# Altium schematic sheet 600V_20A_MotorController_V2.0.SchDoc
size A1
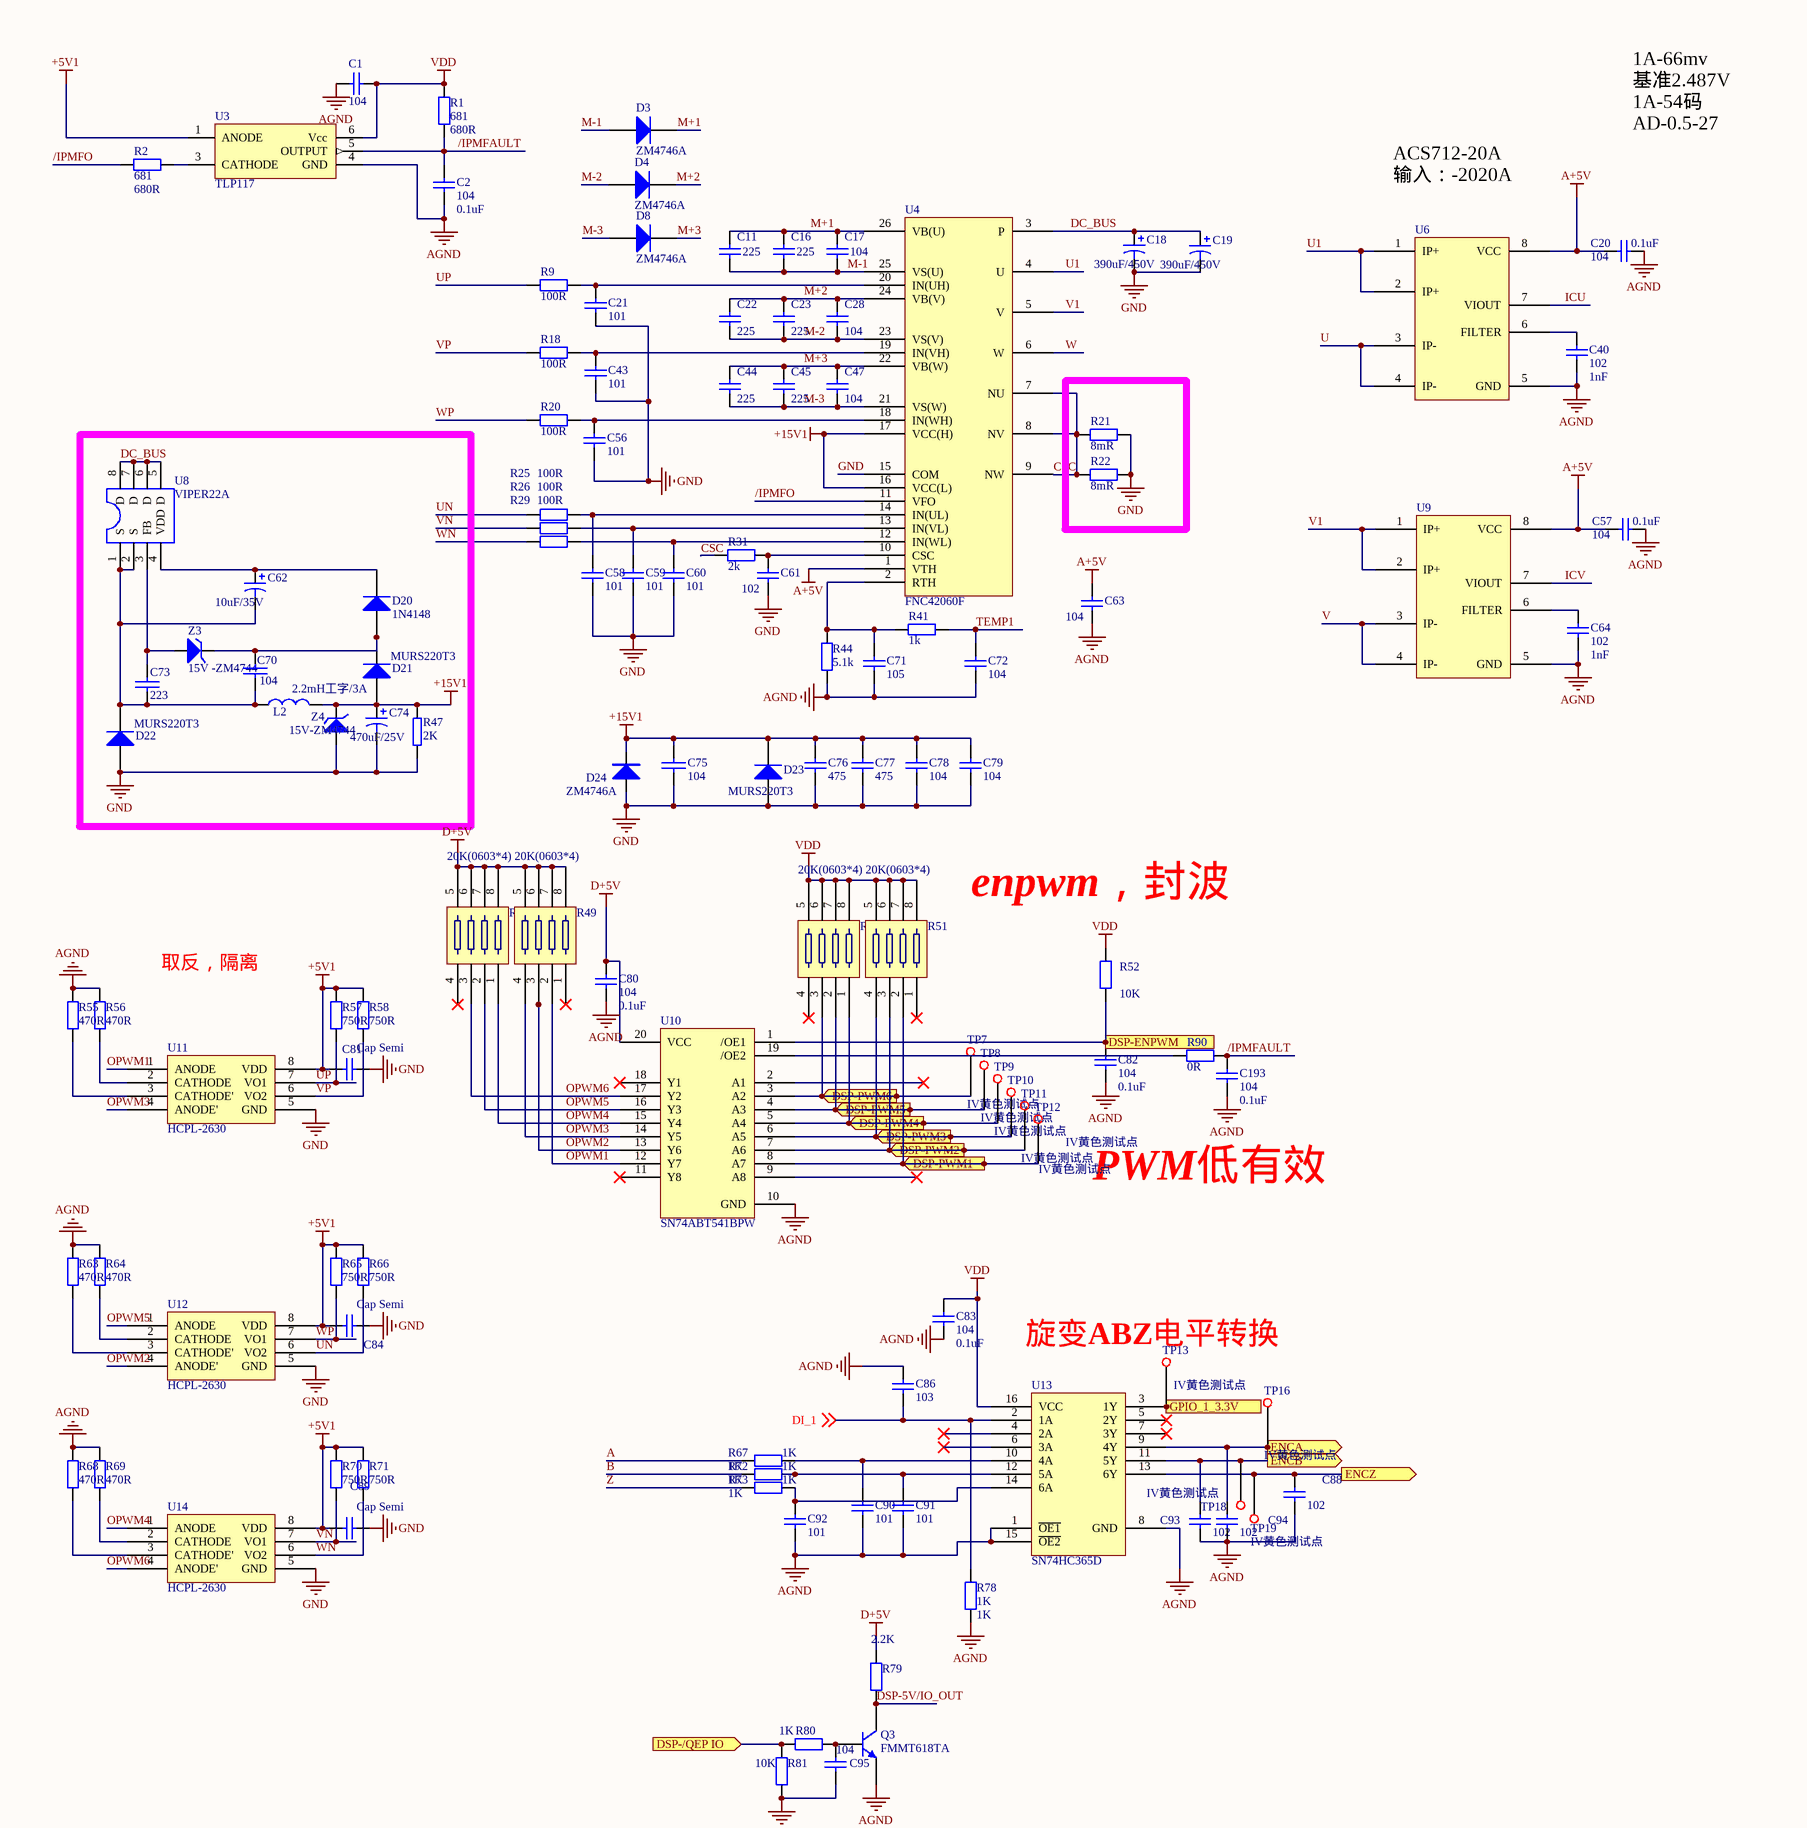
[diagram p0: 600V_20A_MotorController_V2.0.SchDoc, top left]
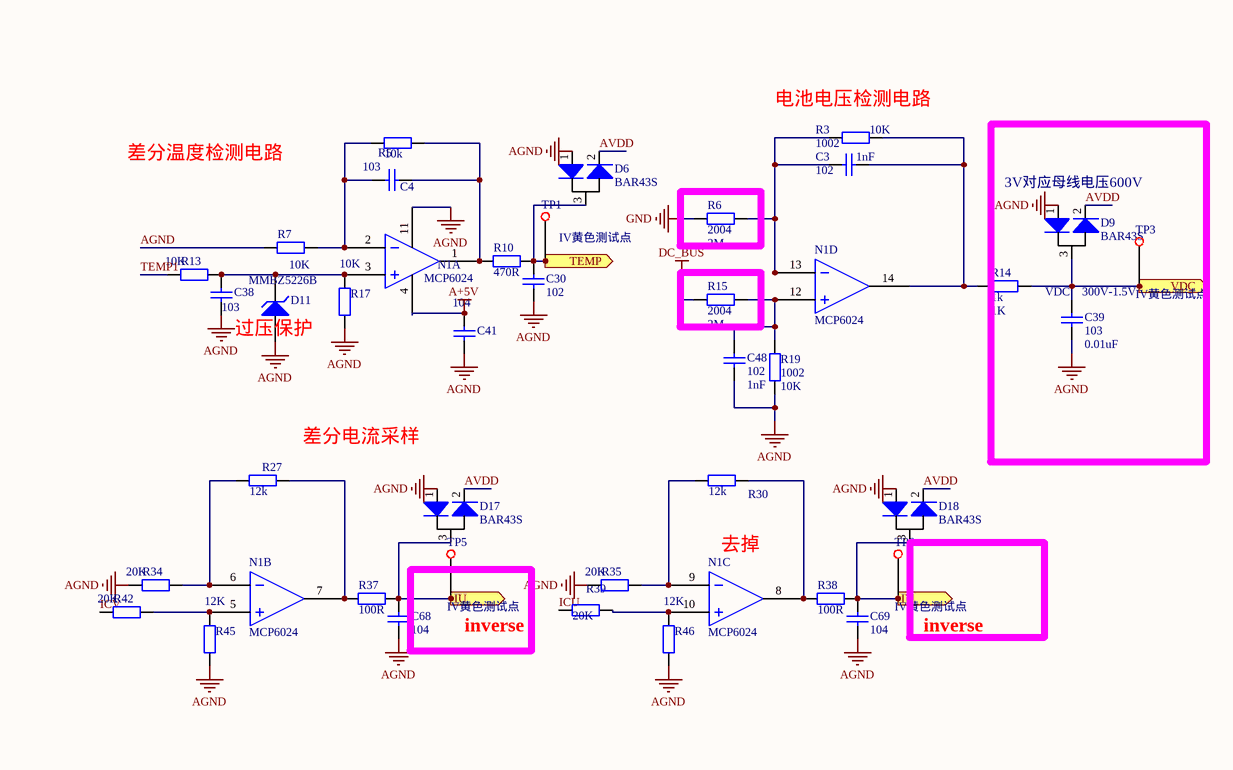
[diagram p1: 600V_20A_MotorController_V2.0.SchDoc, top middle]
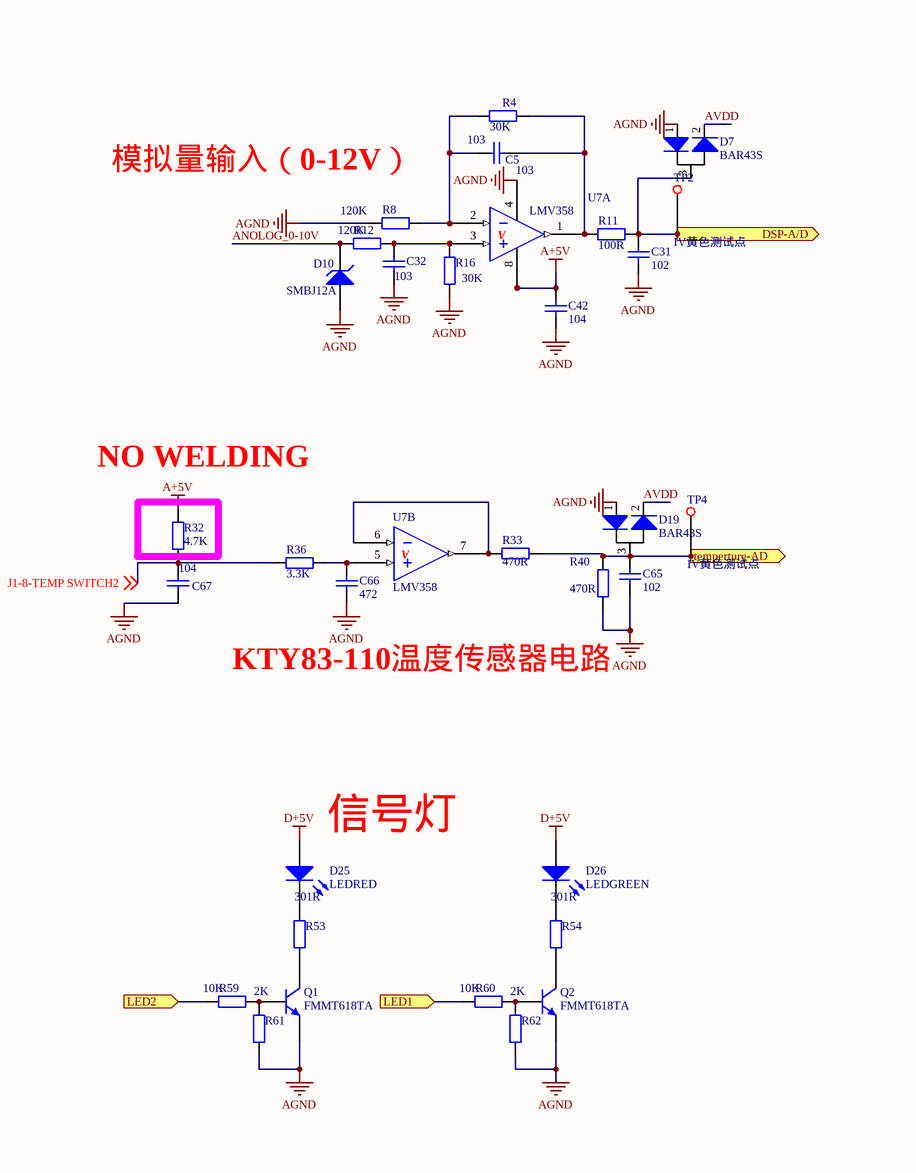
[diagram p2: 600V_20A_MotorController_V2.0.SchDoc, top right]
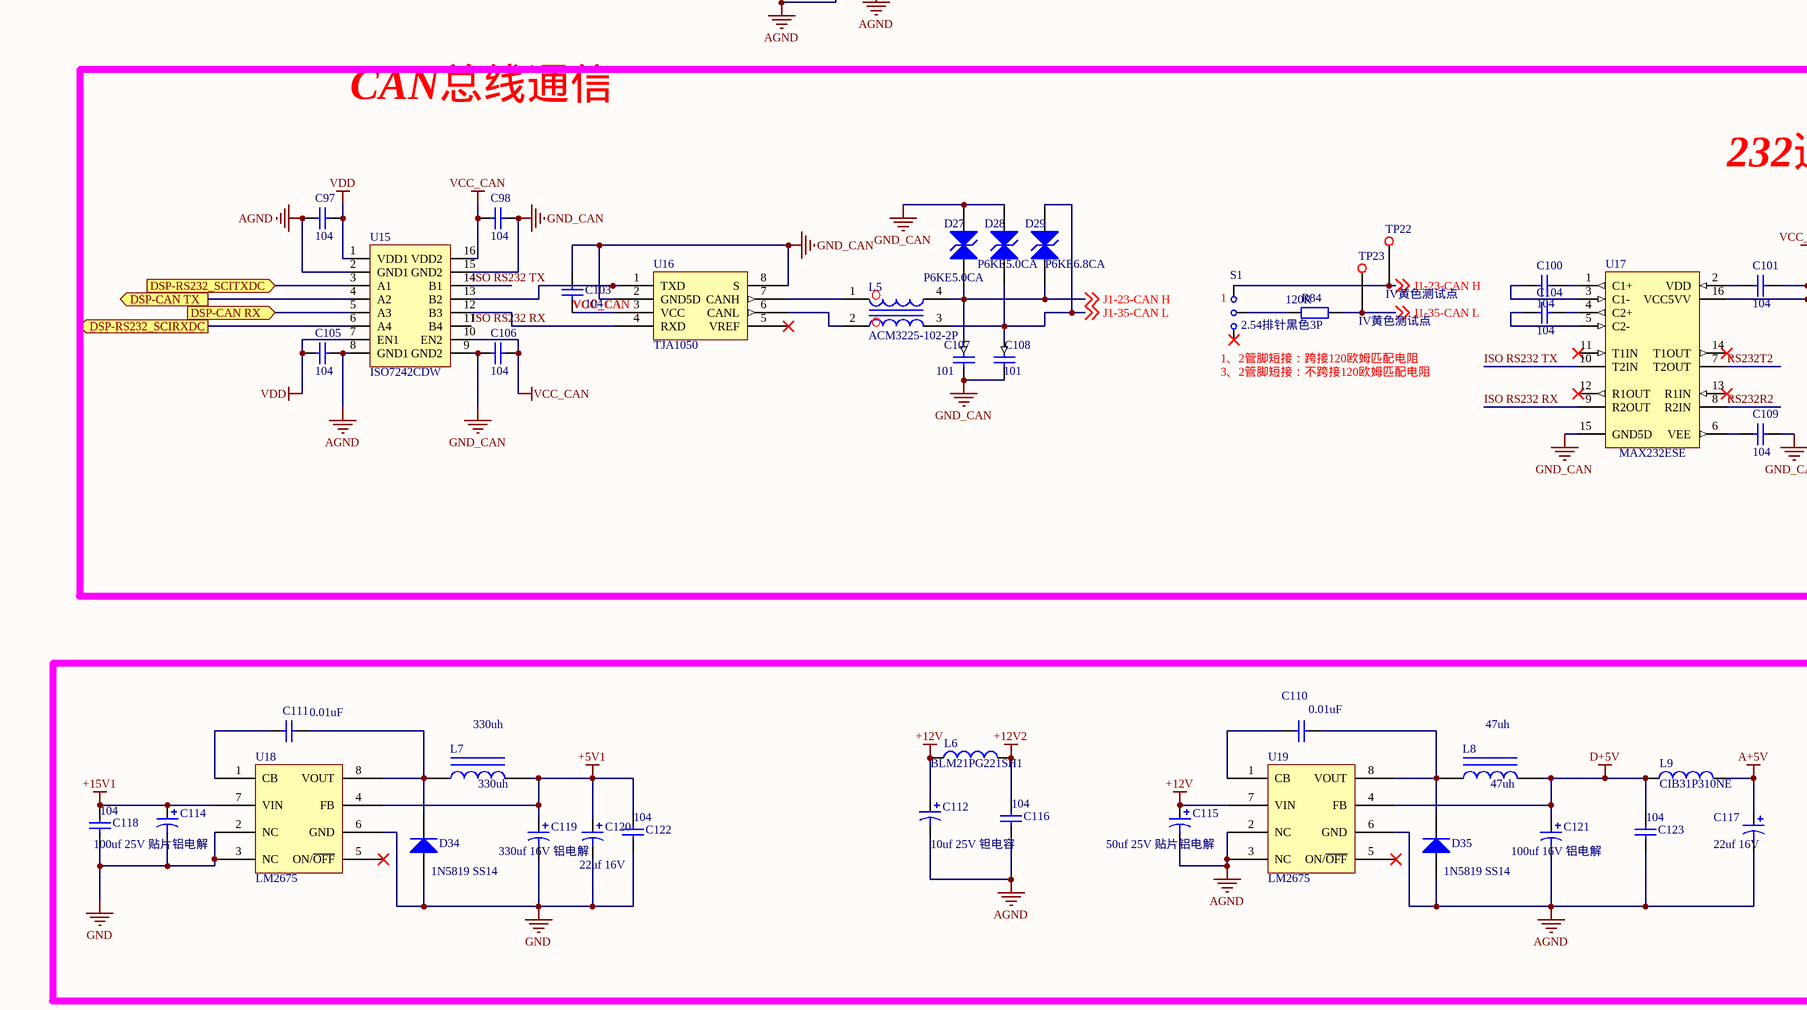
[diagram p3: 600V_20A_MotorController_V2.0.SchDoc, bottom left]
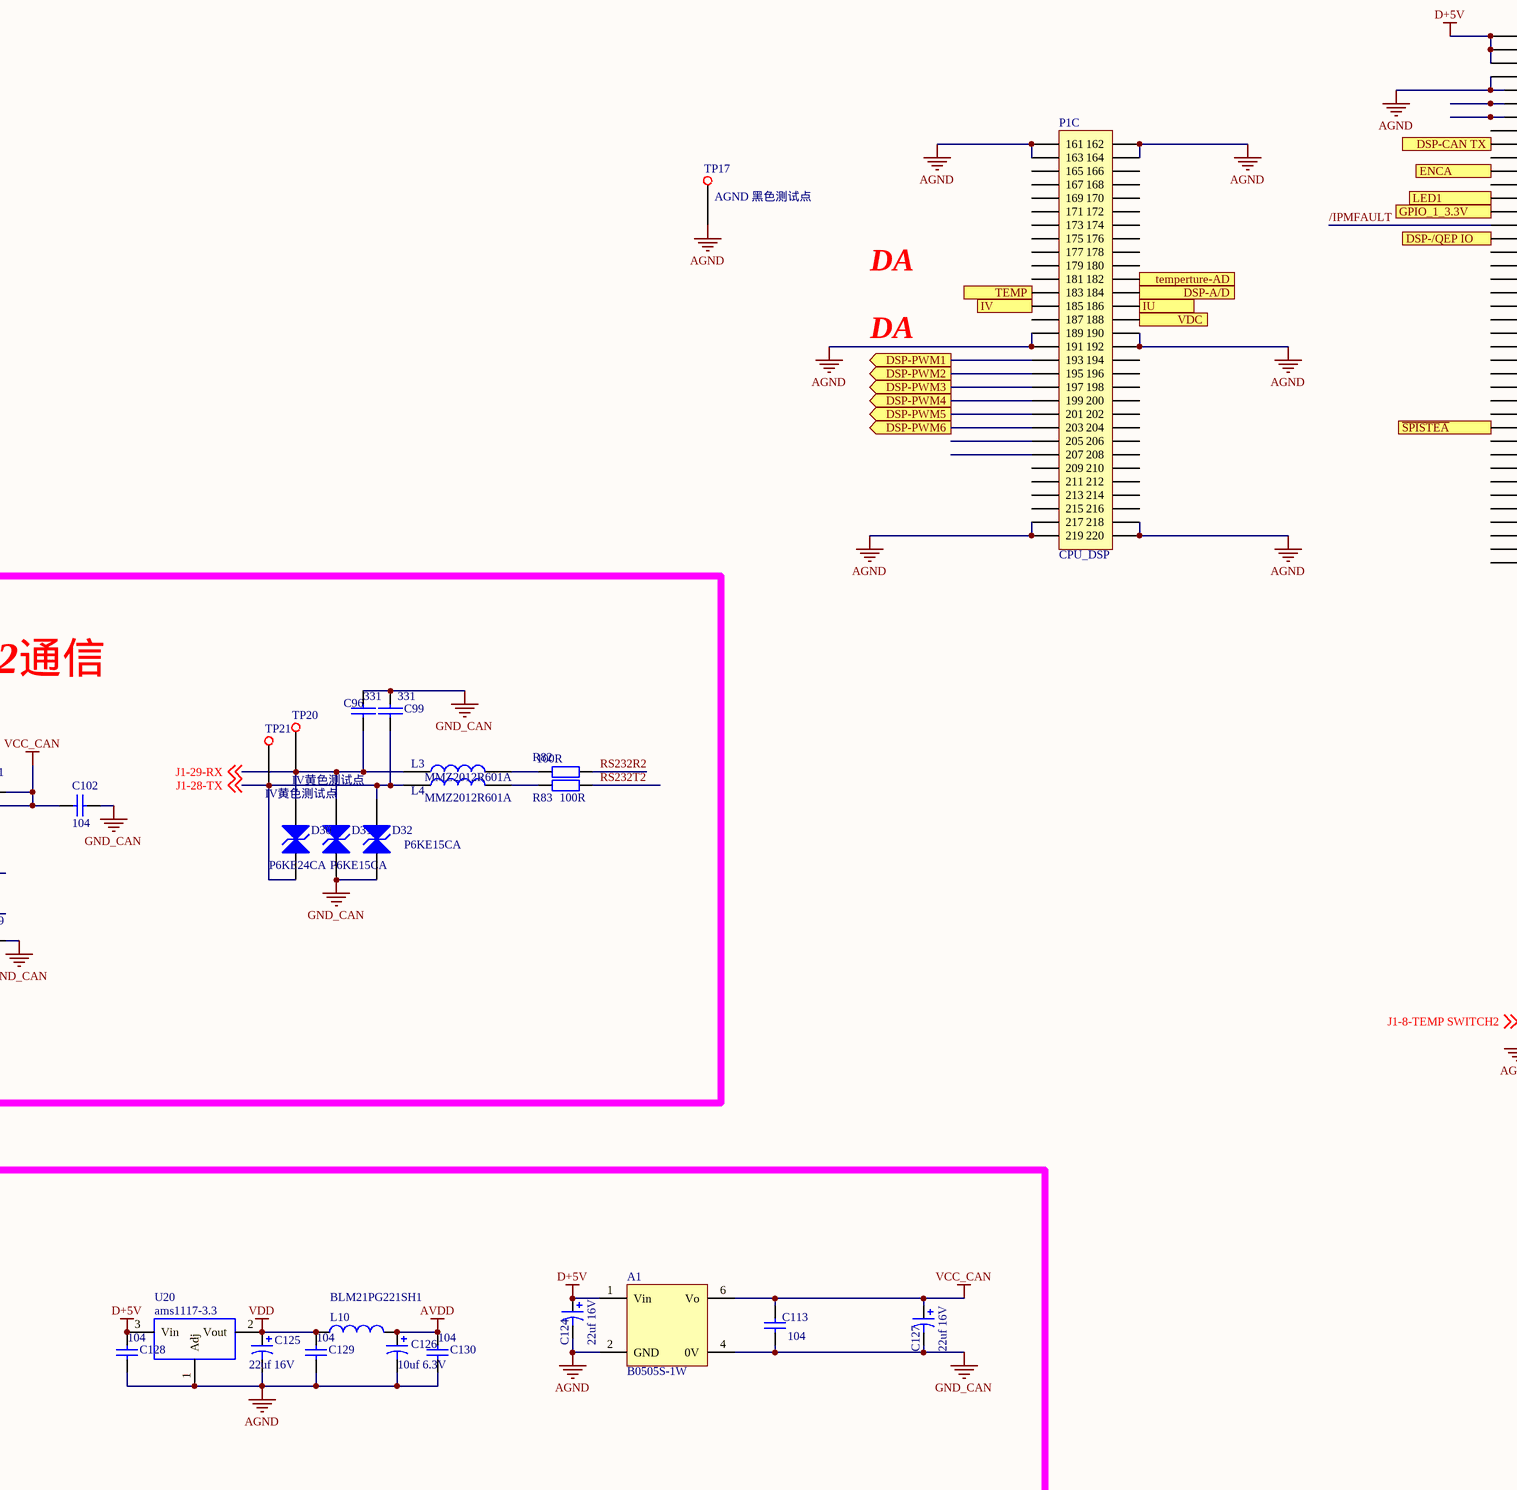
[diagram p4: 600V_20A_MotorController_V2.0.SchDoc, bottom middle]
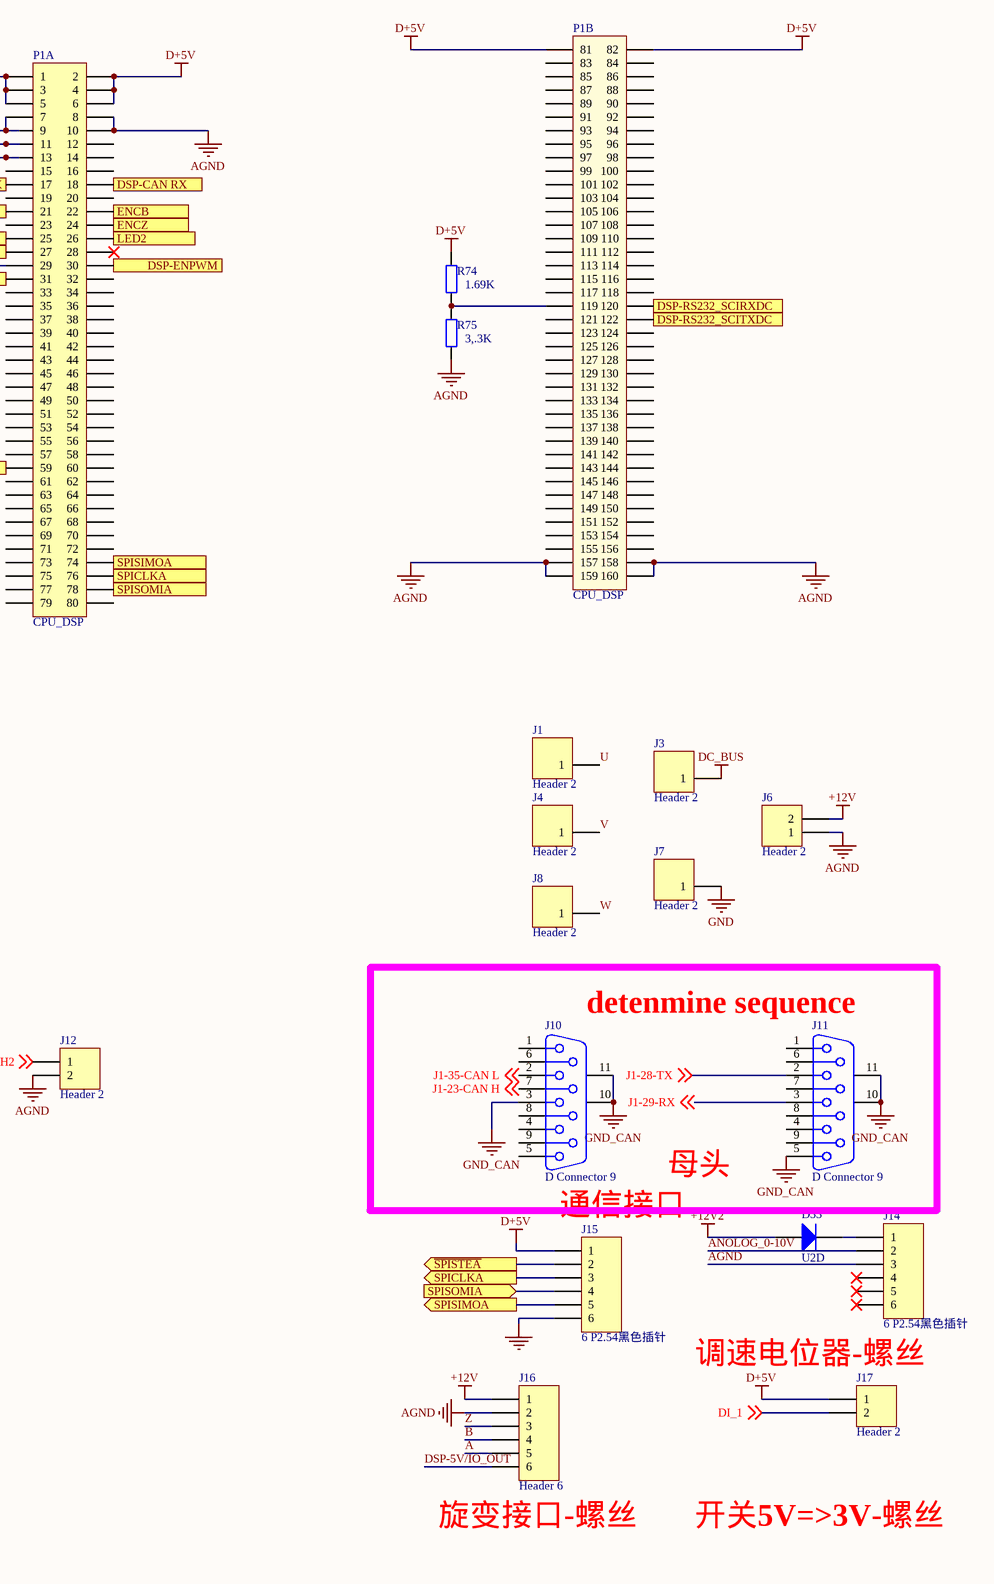
[diagram p5: 600V_20A_MotorController_V2.0.SchDoc, bottom right]

## Parts
A1  B0505S-1W  [B0505S-1W]
C1  Cap  [0805]  (value not drawn)
C2  104  value 0.1uF  [0805]
C3  102  value 1nF  [0805]
C4  103  [0805]
C5  103  [0805]
C11  225  [0805]
C16  225  [0805]
C17  104  [0805]
C18  390uF/450V  [CAP/30mm]
C19  390uF/450V  [CAP/30mm]
C20  104  value 0.1uF  [0805]
C21  101  [0805]
C22  225  [0805]
C23  225  [0805]
C28  104  [0805]
C30  102  [0805]
C31  102  [0805]
C32  103  [0805]
C38  103  [0805]
C39  103  value 0.01uF  [0805]
C40  102  value 1nF  [0805]
C41  104  [0805]
C42  104  [0805]
C43  101  [0805]
C44  225  [0805]
C45  225  [0805]
C47  104  [0805]
C48  102  value 1nF  [0805]
C56  101  [0805]
C57  104  value 0.1uF  [0805]
C58  101  [0805]
C59  101  [0805]
C60  101  [0805]
C61  102  [0805]
C62  10uF/35V  [CAP/6.4mm -]
C63  104  [0805]
C64  102  value 1nF  [0805]
C65  102  [0805]
C66  472  [0805]
C67  104  [0805]
C68  104  [0805]
C69  104  [0805]
C70  104  [0805]
C71  105  [0805]
C72  104  [0805]
C73  223  [0805]
C74  470uF/25V  [CAP/8mm]
C75  104  [0805]
C76  475  [0805]
C77  475  [0805]
C78  104  [0805]
C79  104  [0805]
C80  104  value 0.1uF  [0805]
C81  Cap Semi  [0805]
C82  104  value 0.1uF  [0805]
C83  104  value 0.1uF  [0805]
C84  Cap Semi  [0805]
C86  103  [0805]
C88  102  [0805]
C89  Cap Semi  [0805]
C90  101  [0805]
C91  101  [0805]
C92  101  [0805]
C93  102  [0805]
C94  102  [0805]
C95  104  [0805]
C96  331  [0805]
C97  104  [0805]
C98  104  [0805]
C99  331  [0805]
C100  104  [0805]
C101  104  [0805]
C102  104  [0805]
C103  104  [0805]
C104  104  [0805]
C105  104  [0805]
C106  104  [0805]
C107  101  [0805]
C108  101  [0805]
C109  104  [0805]
C110  0.01uF  [0805]
C111  0.01uF  [0805]
C112  10uf 25V 钽电容  [1206 (钽电容)]
C113  104  [0805]
C114  100uf 25V 贴片铝电解  [CAP/6.4mm -]
C115  50uf 25V 贴片铝电解  [CAP/6.4mm -]
C116  104  [0805]
C117  22uf 16V  [1206 (钽电容)]
C118  104  [0805]
C119  330uf 16V 铝电解  [CAP/8mm]
C120  22uf 16V  [1206 (钽电容)]
C121  100uf 16V 铝电解  [CAP/8mm]
C122  104  [0805]
C123  104  [0805]
C124  22uf 16V  [1206 (钽电容)]
C125  22uf 16V  [1206 (钽电容)]
C126  10uf 6.3V  [1206 (钽电容)]
C127  22uf 16V  [1206 (钽电容)]
C128  104  [0805]
C129  104  [0805]
C130  104  [0805]
C193  104  value 0.1uF  [0805]
D3  ZM4746A  [LL4148]
D4  ZM4746A  [LL4148]
D6  BAR43S  [SOT-23]
D7  BAR43S  [SOT-23]
D8  ZM4746A  [LL4148]
D9  BAR43S  [SOT-23]
D10  SMBJ12A  [DO214AA]
D11  MMBZ5226B  [SOT-23]
D17  BAR43S  [SOT-23]
D18  BAR43S  [SOT-23]
D19  BAR43S  [SOT-23]
D20  1N4148  [LL4148]
D21  MURS220T3  [DO214AA]
D22  MURS220T3  [DO214AA]
D23  MURS220T3  [DO214AA]
D24  ZM4746A  [LL4148]
D25  LEDRED  [L0805]
D26  LEDGREEN  [L0805]
D27  P6KE5.0CA  [DO214AA]
D28  P6KE5.0CA  [DO214AA]
D29  P6KE6.8CA  [DO214AA]
D30  P6KE24CA  [DO214AA]
D31  P6KE15CA  [DO214AA]
D32  P6KE15CA  [DO214AA]
D33  U2D  [DO214AC]
D34  1N5819 SS14  [DO214AC]
D35  1N5819 SS14  [DO214AC]
J1  Header 2  [PCB焊接端子]
J3  Header 2  [PCB焊接端子]
J4  Header 2  [PCB焊接端子]
J6  Header 2  [381S-2]
J7  Header 2  [PCB焊接端子]
J8  Header 2  [PCB焊接端子]
J10  D Connector 9  [DSUB1.385-2H9]
J11  D Connector 9  [DSUB1.385-2H9]
J12  Header 2  [381S-2]
J14  6 P2.54黑色插针  [381S-6]
J15  6 P2.54黑色插针  [6P 100mil]
J16  Header 6  [381S-6]
J17  Header 2  [381S-2]
L2  2.2mH工字/3A  [L\5\10]
L3  MMZ2012R601A  [0805]
L4  MMZ2012R601A  [0805]
L5  ACM3225-102-2P  [ACM3225]
L6  BLM21PG221SH1  [0805]
L7  330uh  [L_7*7]
L8  47uh  [L_7*7]
L9  CIB31P310NE  [1206]
L10  BLM21PG221SH1  [0805]
N1  MCP6024  [SOIC14_M]  (parts A,B,C,D of 4)
P1  CPU_DSP  [DSP_240]  (parts A,B,C of 3)
Q1  FMMT618TA  [SOT-23]
Q2  FMMT618TA  [SOT-23]
Q3  FMMT618TA  [SOT-23]
R1  681  value 680R  [0805]
R2  681  value 680R  [0805]
R3  1002  value 10K  [0805]
R4  30K  [0805]
R5  10k  [0805]
R6  2004  value 2M  [1206]
R7  10K  [0805]
R8  120K  [0805]
R9  100R  [0805]
R10  470R  [0805]
R11  100R  [0805]
R12  120K  [0805]
R13  10K  [0805]
R14  1k  [0805]
R15  2004  value 2M  [1206]
R16  30K  [0805]
R17  10K  [0805]
R18  100R  [0805]
R19  1002  value 10K  [0805]
R20  100R  [0805]
R21  8mR  [2512]
R22  8mR  [2512]
R25  100R  [0805]
R26  100R  [0805]
R27  12k  [0805]
R29  100R  [0805]
R30  12k  [0805]
R31  2k  [0805]
R32  4.7K  [0805]
R33  470R  [0805]
R34  20K  [0805]
R35  20K  [0805]
R36  3.3K  [0805]
R37  100R  [0805]
R38  100R  [0805]
R39  20K  [0805]
R40  470R  [0805]
R41  1k  [0805]
R42  20K  [0805]
R44  5.1k  [0805]
R45  12K  [0805]
R46  12K  [0805]
R47  2K  [1206]
R48  20K(0603*4)  [R_NET4]
R49  20K(0603*4)  [R_NET4]
R50  20K(0603*4)  [R_NET4]
R51  20K(0603*4)  [R_NET4]
R52  10K  [0805]
R53  301R  [0805]
R54  301R  [0805]
R55  470R  [0805]
R56  470R  [0805]
R57  750R  [0805]
R58  750R  [0805]
R59  10K  [0805]
R60  10K  [0805]
R61  2K  [0805]
R62  2K  [0805]
R63  470R  [0805]
R64  470R  [0805]
R65  750R  [0805]
R66  750R  [0805]
R67  1K  [0805]
R68  470R  [0805]
R69  470R  [0805]
R70  750R  [0805]
R71  750R  [0805]
R72  1K  [0805]
R73  1K  [0805]
R74  1.69K  [0805]
R75  3,.3K  [0805]
R78  1K  [0805]
R79  2.2K  [0805]
R80  1K  [0805]
R81  10K  [0805]
R82  100R  [0805]
R83  100R  [0805]
R84  120R  [0805]
R90  0R  [0805]
S1  2.54排针黑色3P  [SIP3]
TP1  IV黄色测试点  [TP]
TP2  IV黄色测试点  [TP]
TP3  IV黄色测试点  [TP]
TP4  IV黄色测试点  [TP]
TP5  IV黄色测试点  [TP]
TP6  IV黄色测试点  [TP]
TP7  IV黄色测试点  [TP]
TP8  IV黄色测试点  [TP]
TP9  IV黄色测试点  [TP]
TP10  IV黄色测试点  [TP]
TP11  IV黄色测试点  [TP]
TP12  IV黄色测试点  [TP]
TP13  IV黄色测试点  [TP]
TP16  IV黄色测试点  [TP]
TP17  AGND 黑色测试点  [TP]
TP18  IV黄色测试点  [TP]
TP19  IV黄色测试点  [TP]
TP20  IV黄色测试点  [TP]
TP21  IV黄色测试点  [TP]
TP22  IV黄色测试点  [TP]
TP23  IV黄色测试点  [TP]
U3  TLP117  [TLP113]
U4  FNC42060F  [FNC42060F]
U6  ACS712  [SOIC-8]  (value not drawn)
U7  LMV358  [so-8]  (parts A,B of 2)
U8  VIPER22A  [DIP8]
U9  ACS712  [SOIC-8]  (value not drawn)
U10  SN74ABT541BPW  [TSSOP-20]
U11  HCPL-2630  [DIP8]
U12  HCPL-2630  [DIP8]
U13  SN74HC365D  [D016_N]
U14  HCPL-2630  [DIP8]
U15  ISO7242CDW  [SOIC16_L]
U16  TJA1050  [sot96-1_n]
U17  MAX232ESE  [NSO16_N]
U18  LM2675  [SOIC-8]
U19  LM2675  [SOIC-8]
U20  ams1117-3.3  [SOT-223]
Z3  15V -ZM4744  [LL4148]
Z4  15V-ZM4744  [LL4148]

## Blocks framed on the sheet
3V对应母线电压600V: C39 D9 R14 TP3

## Ports
DSP-/QEP IO (in), DSP-/QEP IO (out), DSP-A/D (in), DSP-A/D (out), DSP-CAN RX (in), DSP-CAN RX (out), DSP-CAN TX (in), DSP-CAN TX (out), DSP-ENPWM (in), DSP-ENPWM (out), DSP-PWM1 (in), DSP-PWM1 (out), DSP-PWM2 (in), DSP-PWM2 (out), DSP-PWM3 (in), DSP-PWM3 (out), DSP-PWM4 (in), DSP-PWM4 (out), DSP-PWM5 (in), DSP-PWM5 (out), DSP-PWM6 (in), DSP-PWM6 (out), DSP-RS232_SCIRXDC (in), DSP-RS232_SCIRXDC (out), DSP-RS232_SCITXDC (in), DSP-RS232_SCITXDC (out), ENCA (in), ENCA (out), ENCB (in), ENCB (out), ENCZ (in), ENCZ (out), GPIO_1_3.3V (in), GPIO_1_3.3V (out), IU (in), IU (out), IV (in), IV (out), LED1 (in), LED1 (out), LED2 (in), LED2 (out), SPICLKA (in), SPICLKA (out), SPISIMOA (in), SPISIMOA (out), SPISOMIA (in), SPISOMIA (out), TEMP (in), TEMP (out), temperture-AD (in), temperture-AD (out), VDC (in), VDC (out), ~{SPISTEA} (in), ~{SPISTEA} (out)

## Nets
+5V1: C81.1 C84.1 C89.1 C119.1 C120.1 C122.2 L7.2 R57.2 R58.2 R65.2 R66.2 R70.2 R71.2 U3.1(ANODE) U11.8(VDD) U12.8(VDD) U14.8(VDD) U18.4(FB)
+12V: C112.1 C115.1 J6.2 J16.1 L6.1 U19.7(VIN)
+12V2: C116.2 D33.1 L6.2
+15V1: C74.1 C75.1 C76.2 C77.2 C78.2 C79.2 C114.1 C118.2 D21.1(A) D23.2(K) D24.2(K) L2.2 R47.1 U4.16(VCC(L)) U4.17(VCC(H)) U18.7(VIN) Z4.2(K)
A+5V: C20.2 C41.2 C42.2 C57.2 C63.2 C117.1 L9.2 N1.4 R32.1 U4.1(VTH) U6.8(VCC) U7.8 U9.8(VCC)
AGND: A1.2(GND) C1.1 C2.1 C20.1 C30.1 C31.1 C32.1 C38.1 C39.1 C40.1 C41.1 C42.1 C48.1 C57.1 C63.1 C64.1 C65.1 C66.1 C67.1 C68.1 C69.1 C71.1 C72.1 C80.2 C82.1 C83.2 C86.1 C88.2 C90.2 C91.2 C92.2 C93.2 C94.2 C95.2 C97.1 C105.2 C112.2 C115.2 C116.1 C117.2 C121.2 C123.1 C124.2 C125.2 C126.2 C128.1 C129.1 C130.1 C193.1 D6.1 D7.1 D9.1 D10.1(A) D11.1 D17.1 D18.1 D19.1 D35.1 J6.1 J12.2 J14.3 J15.6 J16.2 N1.11 P1.7 P1.8 P1.9 P1.10 P1.157 P1.158 P1.159 P1.160 P1.161 P1.162 P1.163 P1.164 P1.189 P1.190 P1.191 P1.192 P1.217 P1.218 P1.219 P1.220 Q1.2(E) Q2.2(E) Q3.2(E) R7.2 R8.2 R16.2 R17.2 R19.1 R34.2 R35.2 R40.1 R44.1 R45.2 R46.2 R55.2 R56.2 R61.2 R62.2 R63.2 R64.2 R68.2 R69.2 R75.1 R78.1 R81.2 TP17.1 U3.4(GND) U6.5(GND) U7.4 U9.5(GND) U10.10(GND) U13.1(~{OE1}) U13.8(GND) U13.15(~{OE2}) U15.2(GND1) U15.8(GND1) U19.2(NC) U19.3(NC) U19.6(GND) U20.1(Adj)
AVDD: C126.1 C130.2 D6.2 D7.2 D9.2 D17.2 D18.2 D19.2 L10.2
D+5V: A1.1(Vin) C80.1 C121.1 C123.2 C124.1 C128.2 D25.1(A) D26.1(A) J15.1 J17.1 L8.2 L9.1 P1.1 P1.2 P1.3 P1.4 P1.5 P1.6 P1.81 P1.82 R48.5(SDA) R48.6(SCL) R48.7(SQW/OUT) R48.8(VCC) R49.5(SDA) R49.6(SCL) R49.7(SQW/OUT) R49.8(VCC) R74.2 R79.2 U10.20(VCC) U19.4(FB) U20.3(Vin)
DC_BUS: C18.1 C19.1 J3.1 R15.1 U4.3(P) U8.5(D) U8.6(D) U8.7(D) U8.8(D)
GND: C18.2 C19.2 C21.1 C43.1 C56.1 C58.1 C59.1 C60.1 C61.1 C74.2 C75.2 C76.1 C77.1 C78.1 C79.1 C81.2 C84.2 C89.2 C114.2 C118.1 C119.2 C120.2 C122.1 D22.1(A) D23.1(A) D24.1(A) D34.1 J7.1 R6.1 R21.1 R22.1 R47.2 U4.15(COM) U11.5(GND) U12.5(GND) U14.5(GND) U18.2(NC) U18.3(NC) U18.6(GND) Z4.1(A)
GND_CAN: A1.4(0V) C96.1 C98.2 C99.1 C102.2 C103.1 C106.1 C107.1 C108.1 C109.2 C113.1 C127.2 D27.2(K) D28.2(K) D31.1(A) D32.1(A) J10.3 J10.10(MH1) J10.11(MH2) J11.5 J11.10(MH1) J11.11(MH2) U15.9(GND2) U15.15(GND2) U16.2(GND5D) U16.8(S) U17.15(GND5D)
VCC_CAN: A1.6(Vo) C98.1 C101.2 C102.1 C103.2 C106.2 C113.2 C127.1 U15.10(EN2) U15.16(VDD2) U16.3(VCC) U17.16(VCC5VV)
VDD: C1.2 C83.1 C97.2 C105.1 C125.1 C129.2 L10.1 R1.2 R50.5(SDA) R50.6(SCL) R50.7(SQW/OUT) R50.8(VCC) R51.5(SDA) R51.6(SCL) R51.7(SQW/OUT) R51.8(VCC) R52.2 U3.6(Vcc) U13.16(VCC) U15.1(VDD1) U15.7(EN1) U20.2(Vout)
/IPMFAULT: C2.2 C193.2 P1.29 R1.1 R90.1 U3.5(OUTPUT)
/IPMFO: R2.1 U4.11(VFO)
A: J16.5 R67.1
ANOLOG_0-10V: D10.2(K) J14.2 R12.1
B: J16.4 R72.1
CSC: R21.2 R22.2 R31.2 U4.7(NU) U4.8(NV) U4.9(NW)
DI_1: C86.2 J17.2 R78.2 U13.2(1A) ; off-sheet DI_1
DSP-5V/IO_OUT: J16.6 Q3.3(C) R79.1
DSP-/QEP IO: P1.31 R80.2 R81.1 ; port DSP-/QEP IO
DSP-A/D: C31.2 D7.3 P1.184 R11.1 TP2.1 ; port DSP-A/D
DSP-CAN RX: P1.18 U15.5(A3) ; port DSP-CAN RX
DSP-CAN TX: P1.17 U15.4(A2) ; port DSP-CAN TX
DSP-ENPWM: C82.2 P1.30 R52.1 U10.1(/OE1) ; port DSP-ENPWM
DSP-PWM1: P1.193 R51.2(X2) TP12.1 U10.8(A7) ; port DSP-PWM1
DSP-PWM2: P1.195 R51.3(V-BAT) TP11.1 U10.7(A6) ; port DSP-PWM2
DSP-PWM3: P1.197 R51.4(VSS) TP10.1 U10.6(A5) ; port DSP-PWM3
DSP-PWM4: P1.199 R50.1(X1) TP9.1 U10.5(A4) ; port DSP-PWM4
DSP-PWM5: P1.201 R50.2(X2) TP8.1 U10.4(A3) ; port DSP-PWM5
DSP-PWM6: P1.203 R50.3(V-BAT) TP7.1 U10.3(A2) ; port DSP-PWM6
DSP-RS232_SCIRXDC: P1.120 U15.6(A4) ; port DSP-RS232_SCIRXDC
DSP-RS232_SCITXDC: P1.122 U15.3(A1) ; port DSP-RS232_SCITXDC
ENCA: C94.1 P1.21 TP16.1 U13.9(4Y) ; port ENCA
ENCB: C93.1 P1.22 TP18.1 U13.11(5Y) ; port ENCB
ENCZ: C88.1 P1.24 TP19.1 U13.13(6Y) ; port ENCZ
GPIO_1_3.3V: P1.27 TP13.1 U13.3(1Y) ; port GPIO_1_3.3V
ICU: R39.1 U6.7(VIOUT)
ICV: R42.1 U9.7(VIOUT)
ISO RS232 RX: U15.11(B4) U17.9(R2OUT)
ISO RS232 TX: U15.14(B1) U17.10(T2IN)
IU: C68.2 D17.3 P1.186 R37.1 TP5.1 ; port IU
IV: C69.2 D18.3 P1.185 R38.1 TP6.1 ; port IV
J1-8-TEMP SWITCH2: C67.2 J12.1 R32.2 R36.1 ; off-sheet J1-8-TEMP SWITCH2
J1-23-CAN H: C107.2 D27.1(A) D29.1(A) J10.7 L5.4(Sec-) S1.1 TP22.1 ; off-sheet J1-23-CAN H
J1-28-TX: C99.2 D30.1(A) D32.2(K) J11.2 L4.1 TP21.1 ; off-sheet J1-28-TX
J1-29-RX: C96.2 D30.2(K) D31.2(K) J11.3 L3.1 TP20.1 ; off-sheet J1-29-RX
J1-35-CAN L: C108.2 D28.1(A) D29.2(K) J10.2 L5.3(Pri+) R84.1 TP23.1 ; off-sheet J1-35-CAN L
LED1: P1.25 R60.2 ; port LED1
LED2: P1.26 R59.2 ; port LED2
M+1: C11.1 C16.1 C17.1 D3.2(K) U4.26(VB(U))
M+2: C22.1 C23.1 C28.1 D4.2(K) U4.24(VB(V))
M+3: C44.1 C45.1 C47.1 D8.2(K) U4.22(VB(W))
M-1: C11.2 C16.2 C17.2 D3.1(A) U4.25(VS(U))
M-2: C22.2 C23.2 C28.2 D4.1(A) U4.23(VS(V))
M-3: C44.2 C45.2 C47.2 D8.1(A) U4.21(VS(W))
OPWM1: R49.2(X2) U10.12(Y7) U11.1(ANODE)
OPWM2: R49.3(V-BAT) U10.13(Y6) U12.4(ANODE')
OPWM3: R49.4(VSS) U10.14(Y5) U11.4(ANODE')
OPWM4: R48.1(X1) U10.15(Y4) U14.1(ANODE)
OPWM5: R48.2(X2) U10.16(Y3) U12.1(ANODE)
OPWM6: R48.3(V-BAT) U10.17(Y2) U14.4(ANODE')
RS232R2: R82.1 U17.8(R2IN)
RS232T2: R83.1 U17.7(T2OUT)
~{SPISTEA}: J15.2 P1.59 ; port ~{SPISTEA}
SPICLKA: J15.3 P1.76 ; port SPICLKA
SPISIMOA: J15.5 P1.74 ; port SPISIMOA
SPISOMIA: J15.4 P1.78 ; port SPISOMIA
TEMP: C30.2 D6.3 P1.183 R10.1 TP1.1 ; port TEMP
TEMP1: C72.2 R13.1 R41.2
temperture-AD: C65.2 D19.3 P1.182 R33.2 R40.2 TP4.1 ; port temperture-AD
U: J1.1 U6.3(IP-) U6.4(IP-)
U1: U4.4(U) U6.1(IP+) U6.2(IP+)
UN: R25.1 R66.1 U12.6(VO2)
UP: R9.1 R57.1 U11.7(VO1)
V: J4.1 U9.3(IP-) U9.4(IP-)
V1: U4.5(V) U9.1(IP+) U9.2(IP+)
VDC: C39.2 D9.3 P1.188 R14.2 TP3.1 ; port VDC
VN: R26.1 R70.1 U14.7(VO1)
VP: R18.1 R58.1 U11.6(VO2)
W: J8.1 U4.6(W)
WN: R29.1 R71.1 U14.6(VO2)
WP: R20.1 R65.1 U12.7(VO1)
Z: J16.3 R73.1
NetC3_1: C3.1 N1.13 R3.1 R6.2
NetC3_2: C3.2 N1.14 R3.2 R14.1
NetC4_1: C4.1 N1.2 R5.2 R7.1
NetC4_2: C4.2 N1.1 R5.1 R10.2
NetC5_1: C5.1 R4.2 R8.1 U7.2
NetC5_2: C5.2 R4.1 R11.2 U7.1
NetC21_2: C21.2 R9.2 U4.20(IN(UH))
NetC32_2: C32.2 R12.2 R16.1 U7.3
NetC38_2: C38.2 D11.3 N1.3 R13.2 R17.1
NetC40_2: C40.2 U6.6(FILTER)
NetC43_2: C43.2 R18.2 U4.19(IN(VH))
NetC48_2: C48.2 N1.12 R15.2 R19.2
NetC56_2: C56.2 R20.2 U4.18(IN(WH))
NetC58_2: C58.2 R25.2 U4.14(IN(UL))
NetC59_2: C59.2 R26.2 U4.13(IN(VL))
NetC60_2: C60.2 R29.2 U4.12(IN(WL))
NetC61_2: C61.2 R31.1 U4.10(CSC)
NetC62_1: C62.1 D20.2(K) U8.4(VDD)
NetC62_2: C62.2 C70.1 C73.1 D22.2(K) L2.1 U8.1(S) U8.2(S)
NetC64_2: C64.2 U9.6(FILTER)
NetC66_2: C66.2 R36.2 U7.5
NetC70_2: C70.2 D20.1(A) D21.2(K) Z3.2(K)
NetC71_2: C71.2 R41.1 R44.2 U4.2(RTH)
NetC73_2: C73.2 U8.3(FB) Z3.1(A)
NetC90_1: C90.1 R67.2 U13.10(4A)
NetC91_1: C91.1 R72.2 U13.12(5A)
NetC92_1: C92.1 R73.2 U13.14(6A)
NetC95_1: C95.1 Q3.1(B) R80.1
NetC100_1: C100.1 U17.3(C1-)
NetC100_2: C100.2 U17.1(C1+)
NetC101_1: C101.1 U17.2(VDD)
NetC104_1: C104.1 U17.5(C2-)
NetC104_2: C104.2 U17.4(C2+)
NetC109_1: C109.1 U17.6(VEE)
NetC110_1: C110.1 D35.2 L8.1 U19.8(VOUT)
NetC110_2: C110.2 U19.1(CB)
NetC111_1: C111.1 D34.2 L7.1 U18.8(VOUT)
NetC111_2: C111.2 U18.1(CB)
NetD25_2: D25.2(K) R53.2
NetD26_2: D26.2(K) R54.2
NetD33_2: D33.2 J14.1
NetL3_2: L3.2 R82.2
NetL4_2: L4.2 R83.2
NetL5_1: L5.1(Pri+) U16.7(CANH)
NetL5_2: L5.2(Pri-) U16.6(CANL)
NetN1_5: N1.5 R42.2 R45.1
NetN1_6: N1.6 R27.2 R34.1
NetN1_7: N1.7 R27.1 R37.2
NetN1_8: N1.8 R30.1 R38.2
NetN1_9: N1.9 R30.2 R35.1
NetN1_10: N1.10 R39.2 R46.1
NetP1_119: P1.119 R74.1 R75.2
NetQ1_1: Q1.1(B) R59.1 R61.1
NetQ1_3: Q1.3(C) R53.1
NetQ2_1: Q2.1(B) R60.1 R62.1
NetQ2_3: Q2.3(C) R54.1
NetR2_2: R2.2 U3.3(CATHODE)
NetR33_1: R33.1 U7.6 U7.7
NetR55_1: R55.1 U11.3(CATHODE')
NetR56_1: R56.1 U11.2(CATHODE)
NetR63_1: R63.1 U12.3(CATHODE')
NetR64_1: R64.1 U12.2(CATHODE)
NetR68_1: R68.1 U14.3(CATHODE')
NetR69_1: R69.1 U14.2(CATHODE)
NetR84_2: R84.2 S1.2
NetR90_2: R90.2 U10.19(/OE2)
NetU15_12: U15.12(B3) U16.4(RXD)
NetU15_13: U15.13(B2) U16.1(TXD)

Not connected (* = marked no-connect by the designer): J10 1 4 5 6 8 9; J11 1 4 6 7 8 9; J14 4* 5* 6*; P1 11 12 13 14 15 16 19 20 23 28* 32 33 34 35 36 37 38 39 40 41 42 43 44 45 46 47 48 49 50 51 52 53 54 55 56 57 58 60 61 62 63 64 65 66 67 68 69 70 71 72 73 75 77 79 80 83 84 85 86 87 88 89 90 91 92 93 94 95 96 97 98 99 100 101 102 103 104 105 106 107 108 109 110 111 112 113 114 115 116 117 118 121 123 124 125 126 127 128 129 130 131 132 133 134 135 136 137 138 139 140 141 142 143 144 145 146 147 148 149 150 151 152 153 154 155 156 165 166 167 168 169 170 171 172 173 174 175 176 177 178 179 180 181 187 194 196 198 200 202 204 205 206 207 208 209 210 211 212 213 214 215 216; R48 4(VSS)*; R49 1(X1)*; R50 4(VSS)*; R51 1(X1)*; S1 3*; U10 2(A1)* 9(A8)* 11(Y8)* 18(Y1)*; U13 4(2A)* 5(2Y)* 6(3A)* 7(3Y)*; U16 5(VREF)*; U17 11(T1IN)* 12(R1OUT)* 13(R1IN)* 14(T1OUT)*; U18 5(ON/~{OFF})*; U19 5(ON/~{OFF})*

## Notes on the sheet
- (near R3) 电池电压检测电路
- (near U6) ACS712-20A
  输入：-2020A
  输出：05V
- 1A-66mv
  基准2.487V
  1A-54码
  AD-0.5-27
- 差分温度检测电路
- 模拟量输入（0-12V）
- (near C39) VDC    300V-1.5V
- (near D11) 过压保护
- (near R27) 差分电流采样
- (near R32) NO WELDING
- (near N1) 去掉
- inverse
- KTY83-110温度传感器电路
- enpwm，封波
- (near D25) 信号灯
- 取反，隔离
- PWM低有效
- (near TP13) 旋变ABZ电平转换
- DA
- CAN总线通信
- 232通信
- (near S1) 1
- 1、2管脚短接：跨接120欧姆匹配电阻
- 3、2管脚短接：不跨接120欧姆匹配电阻
- detenmine sequence
- 母头
- 通信接口
- 调速电位器-螺丝
- (near J16) 旋变接口-螺丝
- 开关5V=>3V-螺丝
- (in symbol Cap) 104
- (in symbol LM258, part A) A
- (in symbol LM258, part B) A

## Library data of the parts
A1 = IB0505LS-W75
C1-C5 C11 C16 C17 C20-C23 C28 C30 C31 C39-C45 C47 C48 C56-C61 C63-C66 C71 C72 C76-C80 C82 C83 C86 C88 C90-C94 C97 C98 C100-C111 C113 C193 = Cap: Capacitor
  C1: Published: 8-Jun-2000; Revision: July-2002: Re-released for DXP Platform.; Publisher: Altium Limited
  C2 C3 C20 C39 C40 C48 C57 C64-C66 C80 C82 C83 C86 C88 C90-C94 C97 C98 C100-C109 C113 C193: Published: 8-Jun-2000; LatestRevisionDate: 17-Jul-2002; LatestRevisionNote: Re-released for DXP Platform.; PackageReference: RAD-0.3; Publisher: Altium Limited
  C4 C5: Published: 8-Jun-2000; LatestRevisionDate: 17-Jul-2002; LatestRevisionNote: Re-released for DXP Platform.; PackageReference: RAD-0.3; Publisher: Altium Limited; Value: 103
  C11 C16 C17 C21-C23 C28 C43-C45 C47 C56 C58-C61 C63 C71 C72 C76-C79: Published: *; LatestRevisionDate: *; LatestRevisionNote: *; PackageReference: *; Publisher: *
  C30 C31: Published: 8-Jun-2000; LatestRevisionDate: 17-Jul-2002; LatestRevisionNote: Re-released for DXP Platform.; PackageReference: RAD-0.3; Publisher: Altium Limited; Value: 102
  C41 C42: Published: 8-Jun-2000; LatestRevisionDate: 17-Jul-2002; LatestRevisionNote: Re-released for DXP Platform.; PackageReference: RAD-0.3; Publisher: Altium Limited; Value: 104
  C110 C111: Published: 8-Jun-2000; Revision: July-2002: Re-released for DXP Platform.; Publisher: Altium Limited; Value: 0.01uF
C18 C19 C62 C74 C112 C114 C115 C117 C119-C121 C125 C126 = Cap Pol1: Polarized Capacitor (Radial); Published: 8-Jun-2000; LatestRevisionDate: 17-Jul-2002; LatestRevisionNote: Re-released for DXP Platform.; Publisher: Altium Limited
C32 C38 C67 C81 C84 C89 C95 C116 C118 C122 C123 C128-C130 = Cap Semi: Capacitor (Semiconductor SIM Model); Published: 8-Jun-2000; LatestRevisionDate: 17-Jul-2002; LatestRevisionNote: Re-released for DXP Platform.; PackageReference: C1206; Publisher: Altium Limited
C68 C69 = Cap: Capacitor; Value: 101; Published: 8-Jun-2000; LatestRevisionDate: 17-Jul-2002; LatestRevisionNote: Re-released for DXP Platform.; PackageReference: RAD-0.3; Publisher: Altium Limited
C70 C73 C75 = CAP: Capacitor
C96 C99 = 2KWC2.S01_100nf_54
C124 = Cap Pol1: Polarized Capacitor (Radial); Value: 475; Published: 8-Jun-2000; LatestRevisionDate: 17-Jul-2002; LatestRevisionNote: Re-released for DXP Platform.; PackageReference: RB7.6-15; Publisher: Altium Limited
C127 = Cap Pol1: Polarized Capacitor (Radial); Value: 106; Published: 8-Jun-2000; LatestRevisionDate: 17-Jul-2002; LatestRevisionNote: Re-released for DXP Platform.; PackageReference: RB7.6-15; Publisher: Altium Limited
D3 D4 D8 D20 = Diode 1N4148: High Conductance Fast Diode; Published: 8-Jun-2000; LatestRevisionDate: 17-Jul-2002; LatestRevisionNote: Re-released for DXP Platform.; DatasheetDocument: 1997; PackageReference: DO-35; Publisher: Altium Limited; Code_JEDEC: DO-204-AH; ComponentLink1Description: Manufacturer Link; ComponentLink1URL: http://www.fairchildsemi.com/; ComponentLink2Description: Datasheet; ComponentLink2URL: http://www.fairchildsemi.com/ds/1N%2F1N4148.pdf
D6 D7 D9 D17-D19 = MMBD1203二三极管
D10 D11 = D Zener: Zener Diode
  D10: Published: *; LatestRevisionDate: *; LatestRevisionNote: *; PackageReference: *; Publisher: *
  D11: Published: 8-Jun-2000; LatestRevisionDate: 17-Jul-2002; LatestRevisionNote: Re-released for DXP Platform.; PackageReference: DIODE-0.7; Publisher: Altium Limited; PackageDescription: Diode, Thru-Hole; 2 Leads; 0.7 in Pin Spacing
D21-D23 D33-D35 = Diode 1N5408: 3 Amp Medium Power Silicon Rectifier Diode; Published: 8-Jun-2000; LatestRevisionDate: 17-Jul-2002; LatestRevisionNote: Re-released for DXP Platform.; PackageReference: DO-201AD; Publisher: Altium Limited; ComponentLink1Description: Manufacturer Link; ComponentLink1URL: http://www.irf.com/
  D21-D23 D34 D35: DatasheetDocument: Aug-1984
  D33: DatasheetVersion: Aug-1984; PackageDescription: Diode, Axial; Body 9.5 x 5.3 mm (LxDia. max), Lead Dia. 1.32 mm (max)
D24 = DIODE
D25 D26 = LED0: Typical INFRARED GaAs LED; Published: 8-Jun-2000; LatestRevisionDate: 08-Jul-2005; LatestRevisionNote: Mech Layer 1 removed.; PackageReference: LED-0; Publisher: Altium Limited; PackageDescription: LED; 2 Leads
D27-D32 = D ZENER2
J1 J3 J4 J6-J8 J12 J17 = Header 2: Header, 2-Pin; LatestRevisionDate: 17-Jul-2002; LatestRevisionNote: Re-released for DXP Platform.; Publisher: Altium Limited
J10 J11 = D Connector 9: Receptacle Assembly, 9 Position, Right Angle; PackageDocument: O; Positions: 9; Published: 15-Jun-2001; LatestRevisionDate: 17-Jul-2002; LatestRevisionNote: Re-released for DXP Platform.; DatasheetDocument: 1-Sep-1999; PackageReference: 788750; Publisher: Altium Limited; Orientation: Right Angle; Gender: Receptacle
J14-J16 = Header 6: Header, 6-Pin; LatestRevisionDate: 17-Jul-2002; LatestRevisionNote: Re-released for DXP Platform.; Publisher: Altium Limited
L2 = INDUCTOR1: INDUCTOR
L3 L4 = INDUCTOR
L5 = T6
L6 L9 L10 = Inductor: Code_IEC: 1005; Published: 8-Jun-2000; LatestRevisionDate: 17-Jul-2002; LatestRevisionNote: Re-released for DXP Platform.; PackageReference: 0402-A; Publisher: Altium Limited; Code_JEITA: 0402
  L6 L10: Value: BLM21PG221SH1
  L9: Value: CIB31P310NE
L7 L8 = Inductor Iron: Magnetic-Core Inductor; Published: 24-Mar-1999; LatestRevisionDate: 17-Jul-2002; LatestRevisionNote: Re-released for DXP Platform.; PackageReference: AXIAL-0.9; Publisher: Altium Limited
  L7: Value: 330uh
  L8: Value: 47uh
N1 = TL084
Q1-Q3 = NPN: NPN Bipolar Transistor; Published: 8-Jun-2000; LatestRevisionDate: 17-Jul-2002; LatestRevisionNote: Re-released for DXP Platform.; PackageReference: TO-226-AA; Publisher: Altium Limited; PackageDescription: TO, Flat Index; 3 In-Line, Axial Leads; Body Dia. 4.8mm; Leads 0.55 x 0.51 mm (max); Code_JEDEC: TO-226-AA
R1-R3 R5-R7 R9-R11 R13-R15 R17-R20 R25 R26 R29 R31-R33 R36 R40 R41 R44 R52 R55-R73 R78-R84 R90 = Res2: Resistor
  R1-R3 R6 R15 R19 R31 R41 R44 R52 R90: Published: 8-Jun-2000; LatestRevisionDate: 17-Jul-2002; LatestRevisionNote: Re-released for DXP Platform.; PackageReference: AXIAL-0.4; Publisher: Altium Limited
  R5: Published: 8-Jun-2000; LatestRevisionDate: 17-Jul-2002; LatestRevisionNote: Re-released for DXP Platform.; PackageReference: AXIAL-0.4; Publisher: Altium Limited; Value: 10k
  R7 R13 R17 R59 R60: Published: 8-Jun-2000; LatestRevisionDate: 17-Jul-2002; LatestRevisionNote: Re-released for DXP Platform.; PackageReference: AXIAL-0.4; Publisher: Altium Limited; Value: 10K
  R9 R18 R20 R25 R26 R29: Published: *; LatestRevisionDate: *; LatestRevisionNote: *; PackageReference: *; Publisher: *
  R10: Published: 8-Jun-2000; LatestRevisionDate: 17-Jul-2002; LatestRevisionNote: Re-released for DXP Platform.; PackageReference: AXIAL-0.4; Publisher: Altium Limited; Value: 470R
  R11: Published: 8-Jun-2000; LatestRevisionDate: 17-Jul-2002; LatestRevisionNote: Re-released for DXP Platform.; PackageReference: AXIAL-0.4; Publisher: Altium Limited; Value: 100R
  R14 R67 R72 R73 R78: Published: 8-Jun-2000; LatestRevisionDate: 17-Jul-2002; LatestRevisionNote: Re-released for DXP Platform.; PackageReference: AXIAL-0.4; Publisher: Altium Limited; Value: 1K
  R32 R36 R55-R58 R63-R66 R68-R71: Published: 8-Jun-2000; LatestRevisionDate: 17-Jul-2002; LatestRevisionNote: Re-released for DXP Platform.; Publisher: Altium Limited
  R33 R40: Published: 8-Jun-2000; LatestRevisionDate: 17-Jul-2002; LatestRevisionNote: Re-released for DXP Platform.; PackageReference: AXIAL-0.4; Publisher: Altium Limited; PackageDescription: Axial Device, Thru-Hole; 2 Leads; 0.4 in Pin Spacing; Value: 470R
  R61 R62: Published: 8-Jun-2000; LatestRevisionDate: 17-Jul-2002; LatestRevisionNote: Re-released for DXP Platform.; PackageReference: AXIAL-0.4; Publisher: Altium Limited; Value: 2K
  R79: Published: 8-Jun-2000; LatestRevisionDate: 17-Jul-2002; LatestRevisionNote: Re-released for DXP Platform.; PackageReference: AXIAL-0.4; Publisher: Altium Limited; PackageDescription: Axial Device, Thru-Hole; 2 Leads; 0.4 in Pin Spacing; Value: 2.2K
  R80: Published: 8-Jun-2000; LatestRevisionDate: 17-Jul-2002; LatestRevisionNote: Re-released for DXP Platform.; PackageReference: AXIAL-0.4; Publisher: Altium Limited; PackageDescription: Axial Device, Thru-Hole; 2 Leads; 0.4 in Pin Spacing; Value: 1K
  R81: Published: 8-Jun-2000; LatestRevisionDate: 17-Jul-2002; LatestRevisionNote: Re-released for DXP Platform.; PackageReference: AXIAL-0.4; Publisher: Altium Limited; PackageDescription: Axial Device, Thru-Hole; 2 Leads; 0.4 in Pin Spacing; Value: 10K
  R82 R83: Published: 8-Jun-2000; LatestRevisionDate: 17-Jul-2002; LatestRevisionNote: Re-released for DXP Platform.; PackageReference: AXIAL-0.4; Publisher: Altium Limited; PackageDescription: Axial Device, Thru-Hole; 2 Leads; 0.4 in Pin Spacing; Value: 100R
  R84: Published: 8-Jun-2000; LatestRevisionDate: 17-Jul-2002; LatestRevisionNote: Re-released for DXP Platform.; PackageReference: AXIAL-0.4; Publisher: Altium Limited; PackageDescription: Axial Device, Thru-Hole; 2 Leads; 0.4 in Pin Spacing; Value: 120R
R4 R16 = Res2: Resistor; Value: 33K; Published: 8-Jun-2000; LatestRevisionDate: 17-Jul-2002; LatestRevisionNote: Re-released for DXP Platform.; PackageReference: AXIAL-0.4; Publisher: Altium Limited
R8 R12 = Res2: Resistor; Value: 100K; Published: 8-Jun-2000; LatestRevisionDate: 17-Jul-2002; LatestRevisionNote: Re-released for DXP Platform.; PackageReference: AXIAL-0.4; Publisher: Altium Limited
R21 R22 = Res2: Resistor; Value: 3.3K; Published: 8-Jun-2000; LatestRevisionDate: 17-Jul-2002; LatestRevisionNote: Re-released for DXP Platform.; PackageReference: AXIAL-0.4; Publisher: Altium Limited; PackageDescription: Axial Device, Thru-Hole; 2 Leads; 0.4 in Pin Spacing
R27 R30 = Res2: Resistor; Value: 10k; Published: 8-Jun-2000; LatestRevisionDate: 17-Jul-2002; LatestRevisionNote: Re-released for DXP Platform.; PackageReference: AXIAL-0.4; Publisher: Altium Limited
R34 R35 R39 R42 = Res2: Resistor; Value: 15K; Published: 8-Jun-2000; LatestRevisionDate: 17-Jul-2002; LatestRevisionNote: Re-released for DXP Platform.; PackageReference: AXIAL-0.4; Publisher: Altium Limited
R37 R38 = Res2: Resistor; Value: 470R; Published: 8-Jun-2000; LatestRevisionDate: 17-Jul-2002; LatestRevisionNote: Re-released for DXP Platform.; PackageReference: AXIAL-0.4; Publisher: Altium Limited
R45 R46 = Res2: Resistor; Value: 10K; Published: 8-Jun-2000; LatestRevisionDate: 17-Jul-2002; LatestRevisionNote: Re-released for DXP Platform.; PackageReference: AXIAL-0.4; Publisher: Altium Limited
R47 = RES
R48-R51 = R_NET4: Value: 20k
R53 R54 R74 R75 = Res2: Resistor; Value: 300R; Published: 8-Jun-2000; LatestRevisionDate: 17-Jul-2002; LatestRevisionNote: Re-released for DXP Platform.; PackageReference: AXIAL-0.4; Publisher: Altium Limited
S1 = SIP3
TP1-TP13 TP16-TP23 = 测试点
U3 = TLP113
U4 U15 = Component_1
U7 = LM258
U8 = IC/VIPER12
U16 = AT24C02: U?
U17 = MAX232ESE: +5V Powered, Multi-Channel RS-232 Driver/Receiver; Published: 16-Jan-2001; LatestRevisionDate: 13-Apr-2006; LatestRevisionNote: IPC-7351 Footprint Added.; PackageReference: NSO16; Publisher: Altium Limited; PackageDescription: 16-Pin Small Outline Integrated Circuit 1.27 mm Pitch; Code_JEDEC: MS-012-AC; Code_IPC: SOIC127P600-16; ComponentLink1Description: Manufacturer Link; ComponentLink1URL: http://www.maxim-ic.com/; ComponentLink2Description: Datasheet; ComponentLink2URL: http://pdfserv.maxim-ic.com/en/ds/MAX220-MAX249.pdf
U20 = LM1117
Z3 Z4 = ZENER: Zener Diode